# Altium schematic sheet Connection_SCH.SchDoc
size A; SheetNumber: 5; SheetTotal: 8
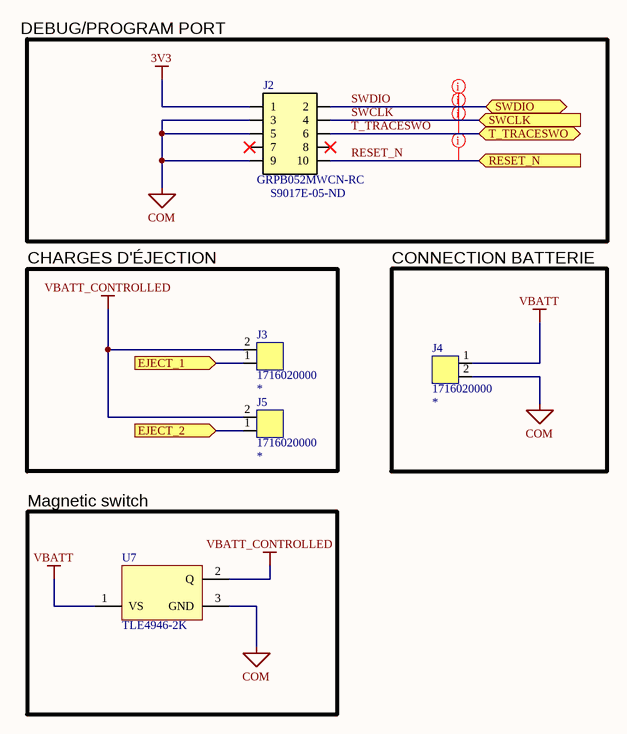
[diagram p0: Connection_SCH.SchDoc]

## Parts
J2  GRPB052MWCN-RC  Supplier Part Number 1: S9017E-05-ND  [HEADER 50MIL 10POS MALE]
J3  1716020000  [1716020000]
J4  1716020000  [1716020000]
J5  1716020000  [1716020000]
U7  TLE4946-2K  [INF-PG-SC59_M]

## Blocks framed on the sheet
CHARGES D'ÉJECTION: J3 J5
CONNECTION BATTERIE: J4
Magnetic switch: U7

## Ports
EJECT_1 (in), EJECT_2 (in), RESET_N (in), SWCLK (in), SWDIO (bidir), T_TRACESWO (bidir)

## Nets
3V3: J2.1
COM: J2.3 J2.5 J2.9 J4.2 U7.3(GND)
VBATT: J4.1 U7.1(VS)
VBATT_CONTROLLED: J3.2 J5.2 U7.2(Q)
EJECT_1: J3.1 ; port EJECT_1
EJECT_2: J5.1 ; port EJECT_2
RESET_N: J2.10 ; port RESET_N
SWCLK: J2.4 ; port SWCLK
SWDIO: J2.2 ; port SWDIO
T_TRACESWO: J2.6 ; port T_TRACESWO

Not connected (* = marked no-connect by the designer): J2 7* 8*

## Layout directives
net class 50_Ohm: RESET_N, SWCLK, SWDIO, T_TRACESWO

## Notes on the sheet
- DEBUG/PROGRAM PORT

## Library data of the parts
J2 = GRPB052MWCN-RC: CONN HEADER R/A 10POS 1.27MM; ComponentLink1URL: http://media.digikey.com/photos/FCI%20Photos/67996-114HLF.JPG; ComponentLink2Description: photo; Supplier 1: Digi-Key
J3-J5 = 1716020000: CONN TERM BLOCK PCB 5.08MM 2POS; Number of Levels: 1; Positions Per Level: 2; Pitch: 0.200" (5.08mm); Mating Orientation: Horizontal with Board; Current: 15A; Voltage: 300V; Wire Gauge: 14-24 AWG; Wire Termination: Screw - Clamping Yoke, Tension Sleeve; Torque - Screw: 0.4-0.5 Nm (3.5-4.4 Lb-In); Screw Thread: M2.5; ComponentLink1Description: Datasheet; ComponentLink1URL: http://media.digikey.com/pdf/Data%20Sheets/Weidmuller%20PDFs/Printed%20Circuit%20Board%20Terminals.pdf#page=14; ComponentLink2URL: http://media.digikey.com/photos/Weidmuller/1716020000.jpg; ComponentLink2Description: Photo; Pricing 1: 1=1.27, 10=1.137, 100=1.0105, 500=0.88418, 1000=0.75786 (USD); Supplier 1: Digi-Key; Mounting Type: Through Hole; Features: Interlocking (Side); Color: Black; Operating Temperature: -50°C ~ 120°C; Housing Material: Thermoplastic, Wemid; Contact Material - Plating: Copper Alloy - Tin Plated; ComponentLink3URL: http://media.digikey.com/pdf/Catalog%20Drawings/Connectors/LM%205.0-90-PCB%20LAY-v1.jpg; ComponentLink3Description: PCB Layout; Supplier Part Number 1: 281-1435-ND; Name: *
U7 = CMP-1148-00006-1: High Precision Hall Effect Latch, PG-SC59, Reel, Green; Manufacturer: Infineon; Brp (25degreesC) typ: -2Â mT; Target Application: Automotive; Interface: open collector; Chopped Hall Technology: TRUE; Bhyst (25degreesC) max: 4Â mT; Direction Detection: FALSE; Bop (25degreesC) min: 2Â mT; ComponentLink3URL: http://www.infineon.com/dgdl/SC59-Package_Overview.pdf?folderId=db3a30431936bc4b01194dc0d34440b0&fileId=db3a30431936bc4b01194dd1aa1d40cf; PackageReference: PG-SC59; ComponentLink1URL: http://www.infineon.com/; Type: Latch; Packing: Reel; PartNumber: TLE4946-2K; Mounting Technology: Surface Mount; ComponentLink2URL: http://www.infineon.com/dgdl/TLE4946-2K_DS_Rev1.pdf?folderId=db3a30431f848401011facc1c83b4674&fileId=db3a30431f848401011fbc925c48637f; DatasheetVersion: Rev. 1.0; PackageVersion: Mar-08; PackageDescription: 3-Pin Semiconductor Package, 3 x 1.53 mm Body, 0.95 mm Pitch; ComponentLink3Description: Package Specification; ComponentLink1Description: Manufacturer URL; ComponentLink2Description: Datasheet; Green: TRUE